# Altium project RMRC V0.1.PrjPcb (part 2 of 2)

## Sheet interface.SchDoc
size A4; SheetNumber: 9; SheetTotal: 9; SPICEModelCacheBYCDXEOE: <root> / <DocumentId>BYCDXEOE</DocumentId> / <CacheFrame Number="0"> / <Model Name="1206_156120rs82500" Kind="CKT"> / <Text>****** / .subckt 1206_156120RS82500  1  2 / D1 1 2 SMRW / .MODEL SMRW D / + IS=404.38E-18 / + N=2.1466 / + RS=.75545 / + IKF=193.03E-6 / + CJO=1.0000E-12 / + M=.3333 / + VJ=.75 / + BV=5 / + IBV=100.00E-6 / + TT=5.0000E-9 / .ends</Text> / </Model> / </CacheFrame> / </root>
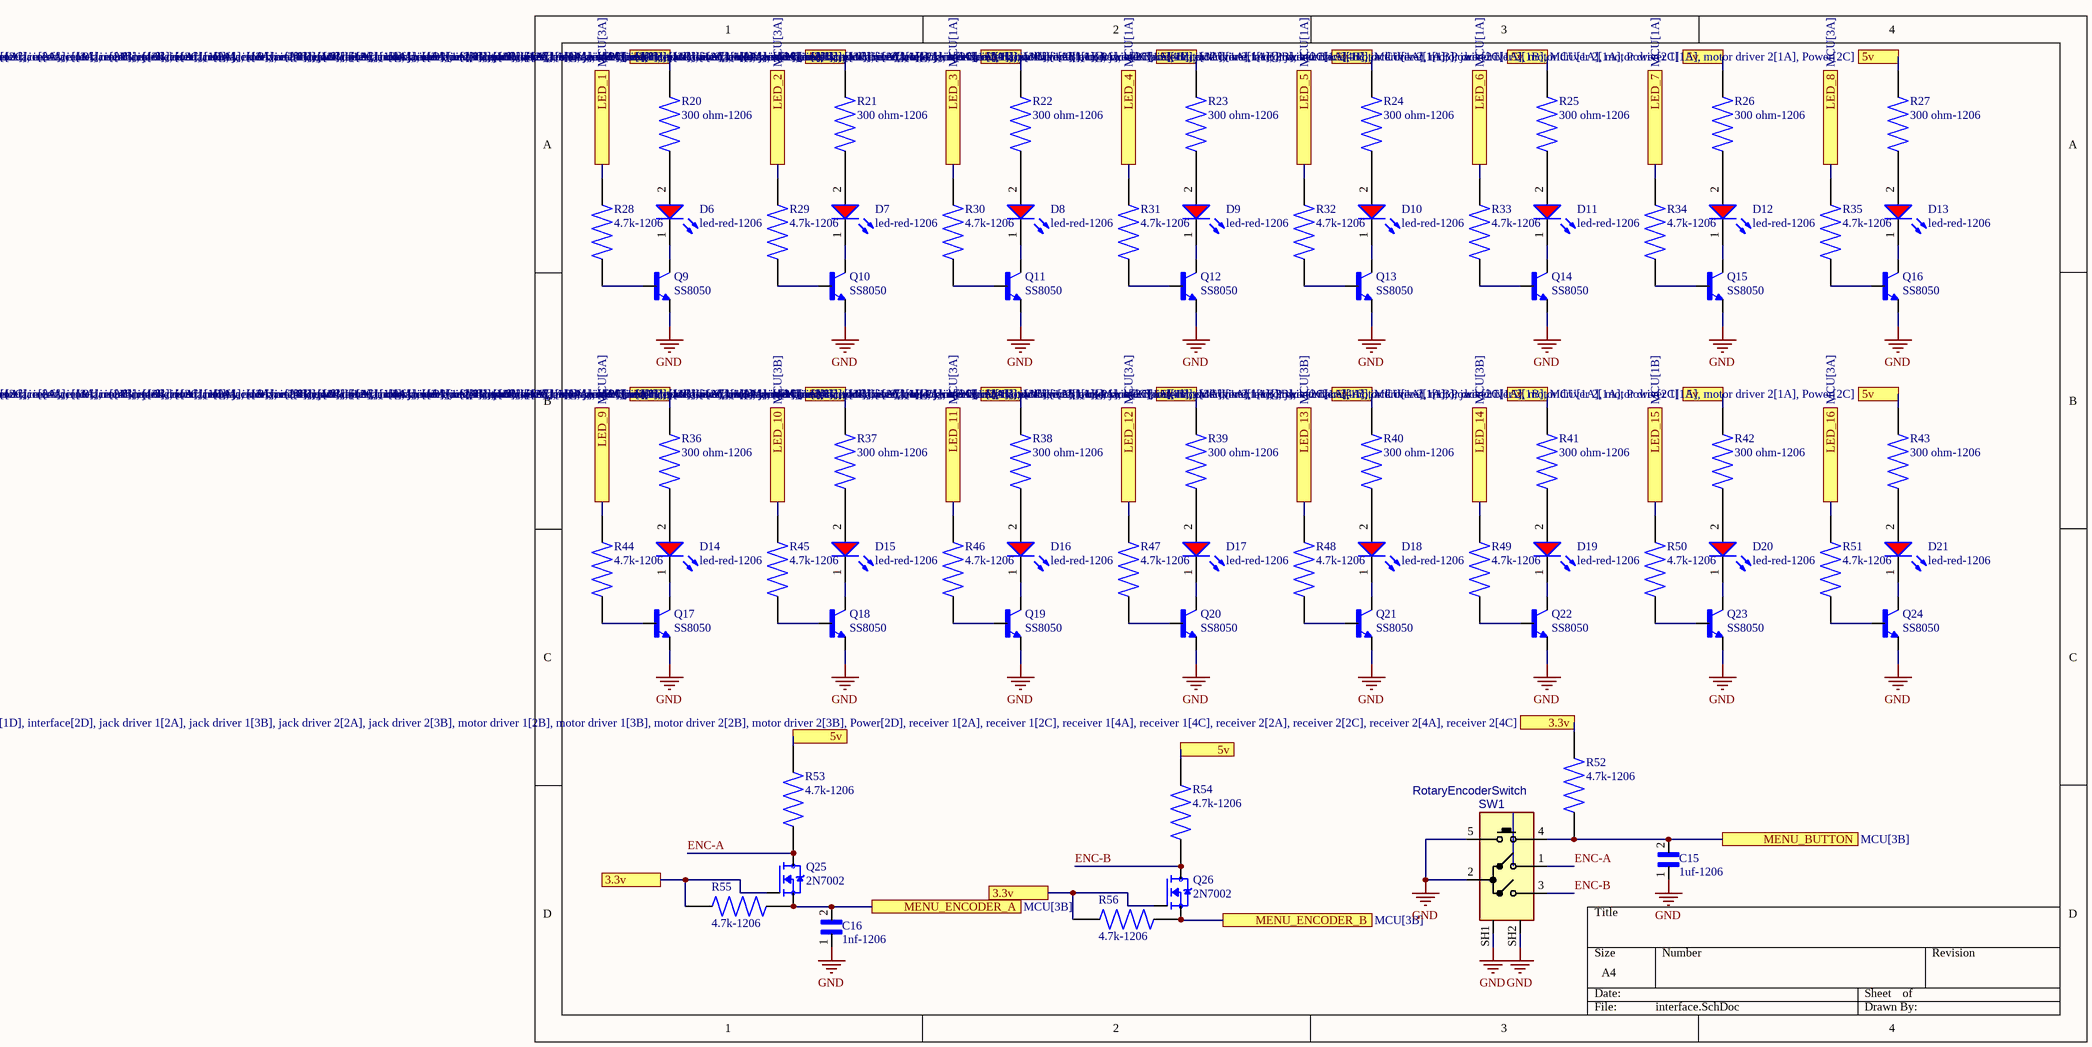
[diagram p8: interface.SchDoc]

### Parts
C15  1uf-1206  [CAPC3216X180N]
C16  1nf-1206  [CAPC3216X180N]
D6  led-red-1206  [WL-SMRW_1206 dome_normal use]
D7  led-red-1206  [WL-SMRW_1206 dome_normal use]
D8  led-red-1206  [WL-SMRW_1206 dome_normal use]
D9  led-red-1206  [WL-SMRW_1206 dome_normal use]
D10  led-red-1206  [WL-SMRW_1206 dome_normal use]
D11  led-red-1206  [WL-SMRW_1206 dome_normal use]
D12  led-red-1206  [WL-SMRW_1206 dome_normal use]
D13  led-red-1206  [WL-SMRW_1206 dome_normal use]
D14  led-red-1206  [WL-SMRW_1206 dome_normal use]
D15  led-red-1206  [WL-SMRW_1206 dome_normal use]
D16  led-red-1206  [WL-SMRW_1206 dome_normal use]
D17  led-red-1206  [WL-SMRW_1206 dome_normal use]
D18  led-red-1206  [WL-SMRW_1206 dome_normal use]
D19  led-red-1206  [WL-SMRW_1206 dome_normal use]
D20  led-red-1206  [WL-SMRW_1206 dome_normal use]
D21  led-red-1206  [WL-SMRW_1206 dome_normal use]
Q9  SS8050  [TRANS_SS8050-G]
Q10  SS8050  [TRANS_SS8050-G]
Q11  SS8050  [TRANS_SS8050-G]
Q12  SS8050  [TRANS_SS8050-G]
Q13  SS8050  [TRANS_SS8050-G]
Q14  SS8050  [TRANS_SS8050-G]
Q15  SS8050  [TRANS_SS8050-G]
Q16  SS8050  [TRANS_SS8050-G]
Q17  SS8050  [TRANS_SS8050-G]
Q18  SS8050  [TRANS_SS8050-G]
Q19  SS8050  [TRANS_SS8050-G]
Q20  SS8050  [TRANS_SS8050-G]
Q21  SS8050  [TRANS_SS8050-G]
Q22  SS8050  [TRANS_SS8050-G]
Q23  SS8050  [TRANS_SS8050-G]
Q24  SS8050  [TRANS_SS8050-G]
Q25  2N7002  [SOT95P240X111-3N]
Q26  2N7002  [SOT95P240X111-3N]
R20  300 ohm-1206  [RESC3015X65N]
R21  300 ohm-1206  [RESC3015X65N]
R22  300 ohm-1206  [RESC3015X65N]
R23  300 ohm-1206  [RESC3015X65N]
R24  300 ohm-1206  [RESC3015X65N]
R25  300 ohm-1206  [RESC3015X65N]
R26  300 ohm-1206  [RESC3015X65N]
R27  300 ohm-1206  [RESC3015X65N]
R28  4.7k-1206  [RESC3015X65N]
R29  4.7k-1206  [RESC3015X65N]
R30  4.7k-1206  [RESC3015X65N]
R31  4.7k-1206  [RESC3015X65N]
R32  4.7k-1206  [RESC3015X65N]
R33  4.7k-1206  [RESC3015X65N]
R34  4.7k-1206  [RESC3015X65N]
R35  4.7k-1206  [RESC3015X65N]
R36  300 ohm-1206  [RESC3015X65N]
R37  300 ohm-1206  [RESC3015X65N]
R38  300 ohm-1206  [RESC3015X65N]
R39  300 ohm-1206  [RESC3015X65N]
R40  300 ohm-1206  [RESC3015X65N]
R41  300 ohm-1206  [RESC3015X65N]
R42  300 ohm-1206  [RESC3015X65N]
R43  300 ohm-1206  [RESC3015X65N]
R44  4.7k-1206  [RESC3015X65N]
R45  4.7k-1206  [RESC3015X65N]
R46  4.7k-1206  [RESC3015X65N]
R47  4.7k-1206  [RESC3015X65N]
R48  4.7k-1206  [RESC3015X65N]
R49  4.7k-1206  [RESC3015X65N]
R50  4.7k-1206  [RESC3015X65N]
R51  4.7k-1206  [RESC3015X65N]
R52  4.7k-1206  [RESC3015X65N]
R53  4.7k-1206  [RESC3015X65N]
R54  4.7k-1206  [RESC3015X65N]
R55  4.7k-1206  [RESC3015X65N]
R56  4.7k-1206  [RESC3015X65N]
SW1  RotaryEncoderSwitch  [SWROT_11MM]

### Ports
3.3v (see interface[1D], interface[2D], jack driver 1[2A], jack driver 1[3B], jack driver 2[2A], jack driver 2[3B], motor driver 1[2B], motor driver 1[3B], motor driver 2[2B], motor driver 2[3B], Power[2D], receiver 1[2A], receiver 1[2C], receiver 1[4A], receiver 1[4C], receiver 2[2A], receiver 2[2C], receiver 2[4A], receiver 2[4C]), 3.3v (see interface[1D], interface[3C], jack driver 1[2A], jack driver 1[3B], jack driver 2[2A], jack driver 2[3B], motor driver 1[2B], motor driver 1[3B], motor driver 2[2B], motor driver 2[3B], Power[2D], receiver 1[2A], receiver 1[2C], receiver 1[4A], receiver 1[4C], receiver 2[2A], receiver 2[2C], receiver 2[4A], receiver 2[4C]), 3.3v (see interface[2D], interface[3C], jack driver 1[2A], jack driver 1[3B], jack driver 2[2A], jack driver 2[3B], motor driver 1[2B], motor driver 1[3B], motor driver 2[2B], motor driver 2[3B], Power[2D], receiver 1[2A], receiver 1[2C], receiver 1[4A], receiver 1[4C], receiver 2[2A], receiver 2[2C], receiver 2[4A], receiver 2[4C]), 5v (see interface[1A], interface[1B], interface[1C], interface[2A], interface[2B], interface[2C], interface[3A], interface[3B], interface[4A], interface[4B], jack driver 1[1B], jack driver 2[1B], MCU[1A], motor driver 1[1A], motor driver 2[1A], Power[2C]), 5v (see interface[1A], interface[1B], interface[1C], interface[2A], interface[2B], interface[2C], interface[3A], interface[3B], interface[4A], jack driver 1[1B], jack driver 2[1B], MCU[1A], motor driver 1[1A], motor driver 2[1A], Power[2C]), 5v (see interface[1A], interface[1B], interface[1C], interface[2A], interface[2B], interface[2C], interface[3A], interface[3B], interface[4B], jack driver 1[1B], jack driver 2[1B], MCU[1A], motor driver 1[1A], motor driver 2[1A], Power[2C]), 5v (see interface[1A], interface[1B], interface[1C], interface[2A], interface[2B], interface[3A], interface[3B], interface[4A], interface[4B], jack driver 1[1B], jack driver 2[1B], MCU[1A], motor driver 1[1A], motor driver 2[1A], Power[2C]), 5v (see interface[1A], interface[1B], interface[2A], interface[2B], interface[2C], interface[3A], interface[3B], interface[4A], interface[4B], jack driver 1[1B], jack driver 2[1B], MCU[1A], motor driver 1[1A], motor driver 2[1A], Power[2C]), LED_1 (see MCU[3A]), LED_2 (see MCU[3A]), LED_3 (see MCU[1A]), LED_4 (see MCU[1A]), LED_5 (see MCU[1A]), LED_6 (see MCU[1A]), LED_7 (see MCU[1A]), LED_8 (see MCU[3A]), LED_9 (see MCU[3A]), LED_10 (see MCU[3B]), LED_11 (see MCU[3A]), LED_12 (see MCU[3A]), LED_13 (see MCU[3B]), LED_14 (see MCU[3B]), LED_15 (see MCU[1B]), LED_16 (see MCU[3A]), MENU_BUTTON (see MCU[3B]), MENU_ENCODER_A (see MCU[3B]), MENU_ENCODER_B (see MCU[3B])

### Nets
3.3v: Q25.1(G) Q26.1(G) R52.2 R55.1 R56.2 ; port 3.3v
GND: C15.1 C16.1 Q9.2(E) Q10.2(E) Q11.2(E) Q12.2(E) Q13.2(E) Q14.2(E) Q15.2(E) Q16.2(E) Q17.2(E) Q18.2(E) Q19.2(E) Q20.2(E) Q21.2(E) Q22.2(E) Q23.2(E) Q24.2(E) SW1.2(C) SW1.5(D) SW1.SH1 SW1.SH2
5v: R20.2 R21.2 R22.2 R23.2 R24.2 R25.2 R26.2 R27.2 R36.2 R37.2 R38.2 R39.2 R40.2 R41.2 R42.2 R43.2 R53.2 R54.2 ; port 5v
ENC-A: Q25.3(D) R53.1 SW1.1(A)
ENC-B: Q26.3(D) R54.1 SW1.3(B)
NetC15_2: C15.2 R52.1 SW1.4(E) ; port MENU_BUTTON
NetC16_2: C16.2 Q25.2(S) R55.2 ; port MENU_ENCODER_A
NetD6_1: D6.1(K) Q9.3(C)
NetD6_2: D6.2(A) R20.1
NetD7_1: D7.1(K) Q10.3(C)
NetD7_2: D7.2(A) R21.1
NetD8_1: D8.1(K) Q11.3(C)
NetD8_2: D8.2(A) R22.1
NetD9_1: D9.1(K) Q12.3(C)
NetD9_2: D9.2(A) R23.1
NetD10_1: D10.1(K) Q13.3(C)
NetD10_2: D10.2(A) R24.1
NetD11_1: D11.1(K) Q14.3(C)
NetD11_2: D11.2(A) R25.1
NetD12_1: D12.1(K) Q15.3(C)
NetD12_2: D12.2(A) R26.1
NetD13_1: D13.1(K) Q16.3(C)
NetD13_2: D13.2(A) R27.1
NetD14_1: D14.1(K) Q17.3(C)
NetD14_2: D14.2(A) R36.1
NetD15_1: D15.1(K) Q18.3(C)
NetD15_2: D15.2(A) R37.1
NetD16_1: D16.1(K) Q19.3(C)
NetD16_2: D16.2(A) R38.1
NetD17_1: D17.1(K) Q20.3(C)
NetD17_2: D17.2(A) R39.1
NetD18_1: D18.1(K) Q21.3(C)
NetD18_2: D18.2(A) R40.1
NetD19_1: D19.1(K) Q22.3(C)
NetD19_2: D19.2(A) R41.1
NetD20_1: D20.1(K) Q23.3(C)
NetD20_2: D20.2(A) R42.1
NetD21_1: D21.1(K) Q24.3(C)
NetD21_2: D21.2(A) R43.1
NetQ9_1: Q9.1(B) R28.1
NetQ10_1: Q10.1(B) R29.1
NetQ11_1: Q11.1(B) R30.1
NetQ12_1: Q12.1(B) R31.1
NetQ13_1: Q13.1(B) R32.1
NetQ14_1: Q14.1(B) R33.1
NetQ15_1: Q15.1(B) R34.1
NetQ16_1: Q16.1(B) R35.1
NetQ17_1: Q17.1(B) R44.1
NetQ18_1: Q18.1(B) R45.1
NetQ19_1: Q19.1(B) R46.1
NetQ20_1: Q20.1(B) R47.1
NetQ21_1: Q21.1(B) R48.1
NetQ22_1: Q22.1(B) R49.1
NetQ23_1: Q23.1(B) R50.1
NetQ24_1: Q24.1(B) R51.1
NetQ26_2: Q26.2(S) R56.1 ; port MENU_ENCODER_B
NetR28_2: R28.2 ; port LED_1
NetR29_2: R29.2 ; port LED_2
NetR30_2: R30.2 ; port LED_3
NetR31_2: R31.2 ; port LED_4
NetR32_2: R32.2 ; port LED_5
NetR33_2: R33.2 ; port LED_6
NetR34_2: R34.2 ; port LED_7
NetR35_2: R35.2 ; port LED_8
NetR44_2: R44.2 ; port LED_9
NetR45_2: R45.2 ; port LED_10
NetR46_2: R46.2 ; port LED_11
NetR47_2: R47.2 ; port LED_12
NetR48_2: R48.2 ; port LED_13
NetR49_2: R49.2 ; port LED_14
NetR50_2: R50.2 ; port LED_15
NetR51_2: R51.2 ; port LED_16

### Library data of the parts
C15 C16 = CGA5L3X8R1H105M160AB: 1ÂµF Â±20% 50V Ceramic Capacitor X8R 1206 (3216 Metric); MF: TDK; Value: *; Purchase-URL: https://pricing.snapeda.com/search/part/CGA5L3X8R1H105M160AB/?ref=eda; Package: 3216 TDK; Availability: In Stock; SnapEDA_Link: https://www.snapeda.com/parts/CGA5L3X8R1H105M160AB/TDK/view-part/?ref=snap; MP: CGA5L3X8R1H105M160AB; Check_prices: https://www.snapeda.com/parts/CGA5L3X8R1H105M160AB/TDK/view-part/?ref=eda; Price: None
D6-D21 = 156120RS82500: WL-SMRW Mono-color Reverse mount Waterclear, SMT, size 1206 dome, Red, 2V, 20°; Manufacturer: Wurth Elektronik; Chip Technology: AlInGaP; Dominant Wavelength: 624nm; Luminous Intensity: 1100mcd; Peak Wavelength: 632nm; Manufacturer Part Number: 156120RS82500; Category: Signal LEDs; Match Code: WL-SMRW; ComponentLink1Description: Website Link; ComponentLink1URL: https://www.we-online.com/redexpert/article/156120RS82500?ad; ComponentLink2Description: Datasheet Link; ComponentLink2URL: https://www.we-online.com/redexpert/spec/156120RS82500?ad; Mount: Surface Mount; Operating Temperature Max: 85°C; Operating Temperature Min: -40°C; Packaging: Tape and Reel; Case/Size Code: 1206 dome; Length: 3.2mm; Width: 1.6mm; Height: 1.85mm; Emitting Color: Red; Forward Voltage: 2V; Viewing Angle: 20°
Q9-Q24 = SS8050-G: Bipolar (BJT) Transistor NPN 25 V 1.5 A 100MHz 300 mW Surface Mount SOT-23-3; MP: SS8050G; MF: Comchip; Digi-Key_Part_Number: 641-1790-2-ND; Check_prices: https://www.snapeda.com/parts/SS8050G/Comchip/view-part/?ref=eda; Package: None; SnapEDA_Link: https://www.snapeda.com/parts/SS8050G/Comchip/view-part/?ref=snap; Value: *
Q25 Q26 = 2N7002: N-Channel 60V 280mA (Ta) 350mW (Ta) Surface Mount SOT-23-3 (TO-236); MF: {'manufacturer': u'onsemi'}; Package: None; Price: None; Value: *; MP: 2N7002; Availability: Unavailable
R20-R56 = CPF1206B10KE1: Res Thin Film 1206 10K Ohm 0.1% 1/8W Â±25ppm/Â°C Molded SMD SMD Paper T/R; Power_Rating: .125 W; MF: TE Connectivity; Voltage_Rating: 150 V; Tolerance: .1%; SnapEDA_Link: https://www.snapeda.com/parts/CPF1206B10KE1/TE+Connectivity/view-part/?ref=snap; Package: 1206; Resistance: 10K; Value: *; MP: CPF1206B10KE1; EU_RoHS_Compliance: Compliant; Check_prices: https://www.snapeda.com/parts/CPF1206B10KE1/TE+Connectivity/view-part/?ref=eda
SW1 = SWROT_11MM: SWITCH, ROTARY Encoder, 11mm Metal Shaft; MANF_PART#: RE111F-41B3N-15F-20P; MANF: Alpha; DESC: DESCRIPTION; ASSEMBLY: ASSEMBLY; PARAM: PARAM; PRICE: -; VALUE: RotaryEncoderSwitch

## Nets that join several sheets
3.3v: Power (C5.1 U2.4), MCU (11 pins), receiver 1 (U4.4 U5.4 U6.4 U7.4), receiver 2 (U8.4 U9.4 U10.4 U11.4), motor driver 1 (Q5.1 Q6.1 R16.2 R17.2), motor driver 2 (Q31.1 Q32.1 R113.2 R114.2), jack driver 1 (Q1.1 Q2.1 R10.2 R11.2), jack driver 2 (Q27.1 Q28.1 R107.2 R108.2), interface (5 pins)
GND: Power (12 pins), MCU (15 pins), receiver 1 (8 pins), receiver 2 (8 pins), motor driver 1 (C14.1 P6.1 Q7.2 Q8.2), motor driver 2 (C27.1 P12.1 Q33.2 Q34.2), jack driver 1 (8 pins), jack driver 2 (8 pins), interface (22 pins)
5v: Power (C3.1 U1.3), MCU (J2.04), motor driver 1 (JP2.1), motor driver 2 (JP4.1), jack driver 1 (JP1.1), jack driver 2 (JP3.1), interface (18 pins)
12v: Power (5 pins), motor driver 1 (5 pins), motor driver 2 (5 pins), jack driver 1 (5 pins), jack driver 2 (5 pins)
NetC4_2: Power (C4.2 R2.1 R3.2), MCU (U3.47)
NetC12_2: MCU (U3.37), jack driver 1 (C12.2 Q2.2 R11.1)
NetC14_2: MCU (U3.29), motor driver 1 (C14.2 Q6.2 R17.1)
NetC15_2: MCU (U3.2), interface (C15.2 R52.1 SW1.4)
NetC16_2: MCU (U3.64), interface (C16.2 Q25.2 R55.2)
NetC17_2: MCU (U3.61), receiver 1 (C17.2 R65.2 U4.3)
NetC18_2: MCU (U3.63), receiver 1 (C18.2 R66.2 U5.3)
NetC19_2: MCU (U3.62), receiver 1 (C19.2 R77.2 U6.3)
NetC20_2: MCU (U3.60), receiver 1 (C20.2 R78.2 U7.3)
NetC21_2: MCU (U3.56), receiver 2 (C21.2 R89.2 U8.3)
NetC22_2: MCU (U3.58), receiver 2 (C22.2 R90.2 U9.3)
NetC23_2: MCU (U3.57), receiver 2 (C23.2 R101.2 U10.3)
NetC24_2: MCU (U3.59), receiver 2 (C24.2 R102.2 U11.3)
NetC25_2: MCU (U3.35), jack driver 2 (C25.2 Q28.2 R108.1)
NetC27_2: MCU (U3.33), motor driver 2 (C27.2 Q32.2 R114.1)
NetJ1_1: Power (J1.1), motor driver 1 (J4.02), motor driver 2 (J13.02)
NetJ1_2: Power (J1.2), motor driver 1 (K3.1 K4.1), motor driver 2 (K7.1 K8.1)
NetQ1_2: MCU (U3.36), jack driver 1 (Q1.2 R10.1)
NetQ5_2: MCU (U3.28), motor driver 1 (Q5.2 R16.1)
NetQ26_2: MCU (U3.1), interface (Q26.2 R56.1)
NetQ27_2: MCU (U3.34), jack driver 2 (Q27.2 R107.1)
NetQ31_2: MCU (U3.32), motor driver 2 (Q31.2 R113.1)
NetR12_2: MCU (U3.54), jack driver 1 (R12.2)
NetR13_2: MCU (U3.55), jack driver 1 (R13.2)
NetR18_2: MCU (U3.24), motor driver 1 (R18.2)
NetR19_2: MCU (U3.27), motor driver 1 (R19.2)
NetR28_2: MCU (U3.16), interface (R28.2)
NetR29_2: MCU (U3.15), interface (R29.2)
NetR30_2: MCU (U3.17), interface (R30.2)
NetR31_2: MCU (U3.21), interface (R31.2)
NetR32_2: MCU (U3.20), interface (R32.2)
NetR33_2: MCU (U3.19), interface (R33.2)
NetR34_2: MCU (U3.18), interface (R34.2)
NetR35_2: MCU (U3.13), interface (R35.2)
NetR44_2: MCU (U3.14), interface (R44.2)
NetR45_2: MCU (U3.3), interface (R45.2)
NetR46_2: MCU (U3.38), interface (R46.2)
NetR47_2: MCU (U3.39), interface (R47.2)
NetR48_2: MCU (U3.40), interface (R48.2)
NetR49_2: MCU (U3.41), interface (R49.2)
NetR50_2: MCU (U3.42), interface (R50.2)
NetR51_2: MCU (U3.48), interface (R51.2)
NetR109_2: MCU (U3.50), jack driver 2 (R109.2)
NetR110_2: MCU (U3.51), jack driver 2 (R110.2)
NetR115_2: MCU (U3.22), motor driver 2 (R115.2)
NetR116_2: MCU (U3.23), motor driver 2 (R116.2)